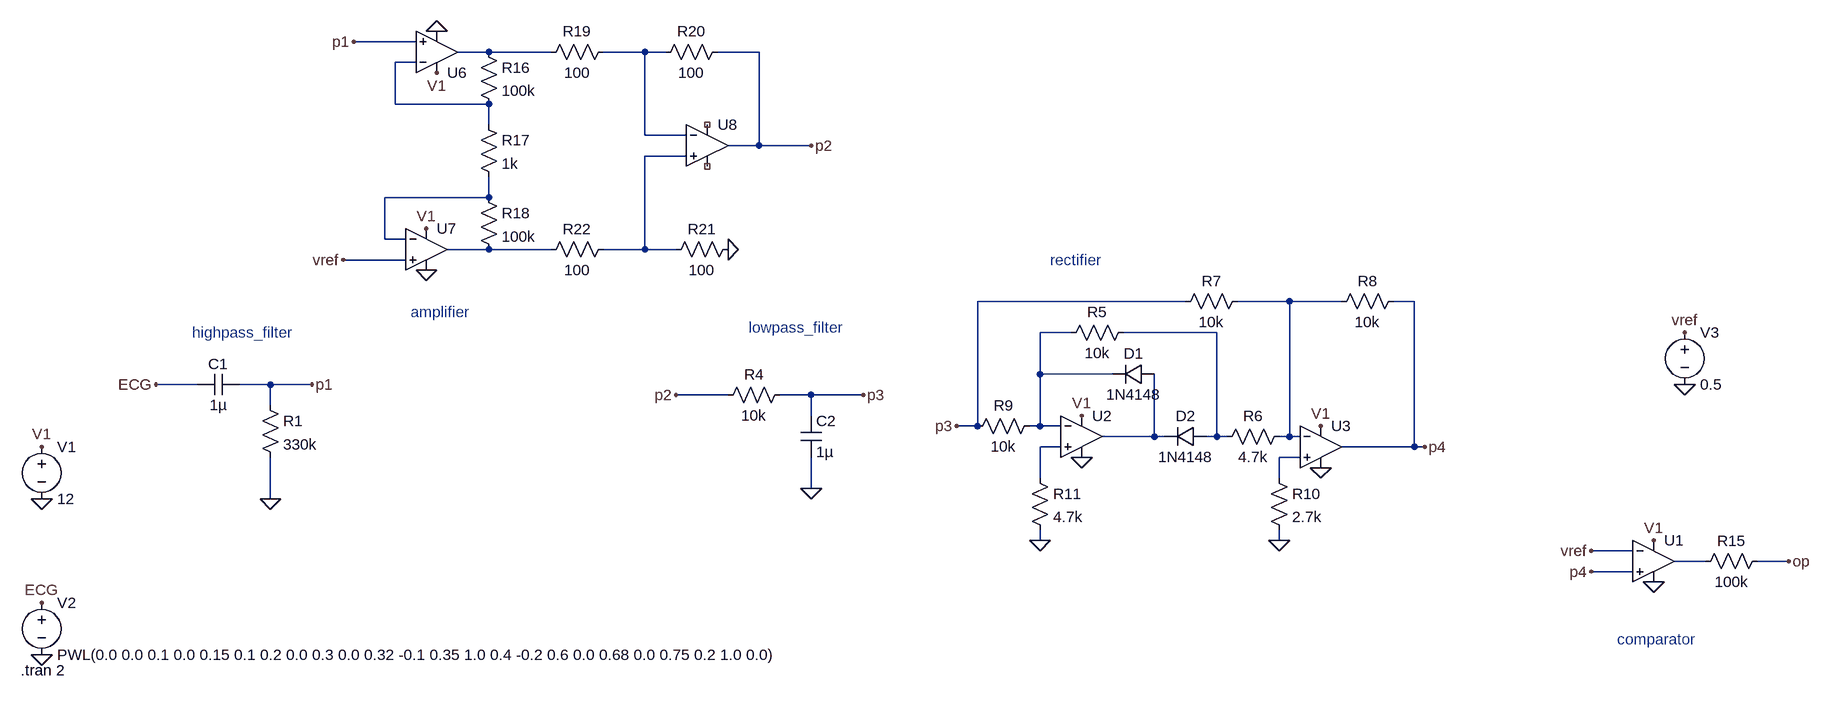
[diagram p0: schematic analog.asc]
analog.asc, the LTspice schematic file:
Version 4.1
SHEET 1 2784 684
WIRE 368 -384 272 -384
WIRE 480 -368 432 -368
WIRE 576 -368 480 -368
WIRE 720 -368 656 -368
WIRE 752 -368 720 -368
WIRE 896 -368 832 -368
WIRE 368 -352 336 -352
WIRE 336 -288 336 -352
WIRE 480 -288 336 -288
WIRE 480 -256 480 -288
WIRE 720 -240 720 -368
WIRE 784 -240 720 -240
WIRE 896 -224 896 -368
WIRE 896 -224 848 -224
WIRE 976 -224 896 -224
WIRE 784 -208 720 -208
WIRE 480 -144 480 -176
WIRE 480 -144 320 -144
WIRE 320 -80 320 -144
WIRE 352 -80 320 -80
WIRE 480 -64 416 -64
WIRE 576 -64 480 -64
WIRE 720 -64 720 -208
WIRE 720 -64 656 -64
WIRE 768 -64 720 -64
WIRE 352 -48 256 -48
WIRE 1552 16 1232 16
WIRE 1712 16 1632 16
WIRE 1792 16 1712 16
WIRE 1904 16 1872 16
WIRE 1376 64 1328 64
WIRE 1600 64 1456 64
WIRE 1328 128 1328 64
WIRE 1440 128 1328 128
WIRE 32 144 -32 144
WIRE 144 144 96 144
WIRE 208 144 144 144
WIRE 848 160 768 160
WIRE 976 160 928 160
WIRE 1056 160 976 160
WIRE 144 176 144 144
WIRE 976 192 976 160
WIRE 1232 208 1232 16
WIRE 1232 208 1200 208
WIRE 1328 208 1328 128
WIRE 1328 208 1312 208
WIRE 1360 208 1328 208
WIRE 1504 224 1504 128
WIRE 1504 224 1424 224
WIRE 1520 224 1504 224
WIRE 1600 224 1600 64
WIRE 1600 224 1584 224
WIRE 1616 224 1600 224
WIRE 1712 224 1712 16
WIRE 1712 224 1696 224
WIRE 1728 224 1712 224
WIRE 1360 240 1328 240
WIRE 1904 240 1904 16
WIRE 1904 240 1792 240
WIRE 1920 240 1904 240
WIRE 1728 256 1696 256
WIRE 1328 288 1328 240
WIRE 1696 288 1696 256
WIRE 976 304 976 256
WIRE 144 320 144 256
WIRE 1328 384 1328 368
WIRE 1696 384 1696 368
WIRE 2240 400 2176 400
WIRE 2352 416 2304 416
WIRE 2480 416 2432 416
WIRE 2240 432 2176 432
FLAG -32 144 ECG
FLAG 208 144 p1
FLAG 144 320 0
FLAG 976 304 0
FLAG 768 160 p2
FLAG 1056 160 p3
FLAG 1328 384 0
FLAG 1696 384 0
FLAG 1200 208 p3
FLAG 1920 240 p4
FLAG 1392 192 V1
FLAG 1760 272 0
FLAG 1392 256 0
FLAG 1760 208 V1
FLAG 2272 384 V1
FLAG 2272 448 0
FLAG 2480 416 op
FLAG -208 320 0
FLAG -208 240 V1
FLAG -208 560 0
FLAG -208 480 ECG
FLAG 256 -48 vref
FLAG 976 -224 p2
FLAG 848 -64 0
FLAG 272 -384 p1
FLAG 400 -400 0
FLAG 400 -336 V1
FLAG 384 -32 0
FLAG 384 -96 V1
FLAG 2176 400 vref
FLAG 2176 432 p4
FLAG 2320 144 0
FLAG 2320 64 vref
SYMBOL cap 96 128 R90
WINDOW 0 0 32 VBottom 2
WINDOW 3 32 32 VTop 2
SYMATTR InstName C1
SYMATTR Value 1µ
SYMBOL res 128 160 R0
SYMATTR InstName R1
SYMATTR Value 330k
SYMBOL voltage -208 224 R0
SYMATTR InstName V1
SYMATTR Value 12
SYMBOL res 944 144 R90
WINDOW 0 0 56 VBottom 2
WINDOW 3 32 56 VTop 2
SYMATTR InstName R4
SYMATTR Value 10k
SYMBOL cap 960 192 R0
SYMATTR InstName C2
SYMATTR Value 1µ
SYMBOL OpAmps\\UniversalOpAmp 1392 224 R0
SYMATTR InstName U2
SYMBOL OpAmps\\UniversalOpAmp 1760 240 R0
SYMATTR InstName U3
SYMBOL diode 1504 112 R90
WINDOW 0 0 32 VBottom 2
WINDOW 3 32 32 VTop 2
SYMATTR InstName D1
SYMATTR Value 1N4148
SYMBOL diode 1584 208 R90
WINDOW 0 0 32 VBottom 2
WINDOW 3 32 32 VTop 2
SYMATTR InstName D2
SYMATTR Value 1N4148
SYMBOL res 1472 48 R90
WINDOW 0 0 56 VBottom 2
WINDOW 3 32 56 VTop 2
SYMATTR InstName R5
SYMATTR Value 10k
SYMBOL res 1712 208 R90
WINDOW 0 0 56 VBottom 2
WINDOW 3 32 56 VTop 2
SYMATTR InstName R6
SYMATTR Value 4.7k
SYMBOL res 1648 0 R90
WINDOW 0 0 56 VBottom 2
WINDOW 3 32 56 VTop 2
SYMATTR InstName R7
SYMATTR Value 10k
SYMBOL res 1888 0 R90
WINDOW 0 0 56 VBottom 2
WINDOW 3 32 56 VTop 2
SYMATTR InstName R8
SYMATTR Value 10k
SYMBOL res 1328 192 R90
WINDOW 0 0 56 VBottom 2
WINDOW 3 32 56 VTop 2
SYMATTR InstName R9
SYMATTR Value 10k
SYMBOL res 1680 272 R0
SYMATTR InstName R10
SYMATTR Value 2.7k
SYMBOL res 1312 272 R0
SYMATTR InstName R11
SYMATTR Value 4.7k
SYMBOL voltage -208 464 R0
WINDOW 123 0 0 Left 0
WINDOW 39 0 0 Left 0
SYMATTR InstName V2
SYMATTR Value PWL(0.0 0.0 0.1 0.0 0.15 0.1 0.2 0.0 0.3 0.0 0.32 -0.1 0.35 1.0 0.4 -0.2 0.6 0.0 0.68 0.0 0.75 0.2 1.0 0.0)
SYMBOL res 2448 400 R90
WINDOW 0 0 56 VBottom 2
WINDOW 3 32 56 VTop 2
SYMATTR InstName R15
SYMATTR Value 100k
SYMBOL OpAmps\\UniversalOpAmp2 400 -368 M180
SYMATTR InstName U6
SYMBOL OpAmps\\UniversalOpAmp2 384 -64 R0
SYMATTR InstName U7
SYMBOL OpAmps\\UniversalOpAmp2 816 -224 R0
SYMATTR InstName U8
SYMBOL res 464 -384 R0
SYMATTR InstName R16
SYMATTR Value 100k
SYMBOL res 464 -272 R0
SYMATTR InstName R17
SYMATTR Value 1k
SYMBOL res 464 -160 R0
SYMATTR InstName R18
SYMATTR Value 100k
SYMBOL res 672 -384 R90
WINDOW 0 0 56 VBottom 2
WINDOW 3 32 56 VTop 2
SYMATTR InstName R19
SYMATTR Value 100
SYMBOL res 848 -384 R90
WINDOW 0 0 56 VBottom 2
WINDOW 3 32 56 VTop 2
SYMATTR InstName R20
SYMATTR Value 100
SYMBOL res 864 -80 R90
WINDOW 0 0 56 VBottom 2
WINDOW 3 32 56 VTop 2
SYMATTR InstName R21
SYMATTR Value 100
SYMBOL res 672 -80 R90
WINDOW 0 0 56 VBottom 2
WINDOW 3 32 56 VTop 2
SYMATTR InstName R22
SYMATTR Value 100
SYMBOL voltage 2320 48 R0
WINDOW 123 0 0 Left 0
WINDOW 39 0 0 Left 0
SYMATTR InstName V3
SYMATTR Value 0.5
SYMBOL OpAmps\\UniversalOpAmp2 2272 416 R0
SYMATTR InstName U1
TEXT 24 64 Left 2 ;highpass_filter
TEXT 360 32 Left 2 ;amplifier
TEXT 880 56 Left 2 ;lowpass_filter
TEXT 1344 -48 Left 2 ;rectifier
TEXT 2216 536 Left 2 ;comparator
TEXT -240 584 Left 2 !.tran 2

The netlist it stands for:
* analog.asc
C1 p1 ECG 1µ
R1 p1 0 330k
V1 V1 0 12
R4 p3 p2 10k
C2 p3 0 1µ
X§U2 N011 N008 V1 0 N010 level1 Avol=1Meg GBW=10Meg Vos=0 En=0 Enk=0 In=0 Ink=0 Rin=500Meg  ; pins In+ In- V+ V- OUT
X§U3 N012 N007 V1 0 p4 level1 Avol=1Meg GBW=10Meg Vos=0 En=0 Enk=0 In=0 Ink=0 Rin=500Meg  ; pins In+ In- V+ V- OUT
D1 N010 N008 1N4148
D2 N009 N010 1N4148
R5 N009 N008 10k
R6 N007 N009 4.7k
R7 N007 p3 10k
R8 p4 N007 10k
R9 N008 p3 10k
R10 N012 0 2.7k
R11 N011 0 4.7k
V2 ECG 0 PWL(0.0 0.0 0.1 0.0 0.15 0.1 0.2 0.0 0.3 0.0 0.32 -0.1 0.35 1.0 0.4 -0.2 0.6 0.0 0.68 0.0 0.75 0.2 1.0 0.0)
R15 op N013 100k
X§U6 p1 N003 V1 0 N001 level2 Avol=1Meg GBW=10Meg Slew=10Meg Ilimit=25m Rail=0 Vos=0 En=0 Enk=0 In=0 Ink=0 Rin=500Meg  ; pins In+ In- V+ V- OUT
X§U7 vref N005 V1 0 N006 level2 Avol=1Meg GBW=10Meg Slew=10Meg Ilimit=25m Rail=0 Vos=0 En=0 Enk=0 In=0 Ink=0 Rin=500Meg  ; pins In+ In- V+ V- OUT
X§U8 N004 N002 NC_01 NC_02 p2 level2 Avol=1Meg GBW=10Meg Slew=10Meg Ilimit=25m Rail=0 Vos=0 En=0 Enk=0 In=0 Ink=0 Rin=500Meg  ; pins In+ In- V+ V- OUT
R16 N001 N003 100k
R17 N003 N005 1k
R18 N005 N006 100k
R19 N002 N001 100
R20 p2 N002 100
R21 0 N004 100
R22 N004 N006 100
V3 vref 0 0.5
X§U1 p4 vref V1 0 N013 level2 Avol=1Meg GBW=10Meg Slew=10Meg Ilimit=25m Rail=0 Vos=0 En=0 Enk=0 In=0 Ink=0 Rin=500Meg  ; pins In+ In- V+ V- OUT
.model D D
.lib standard.dio
* highpass_filter
* amplifier
* lowpass_filter
* rectifier
* comparator
.tran 2
.lib UniversalOpAmp1.lib
.lib UniversalOpAmp2.lib
.backanno
.end